# EAGLE schematic SolarZ (EAGLE 9.3.1)
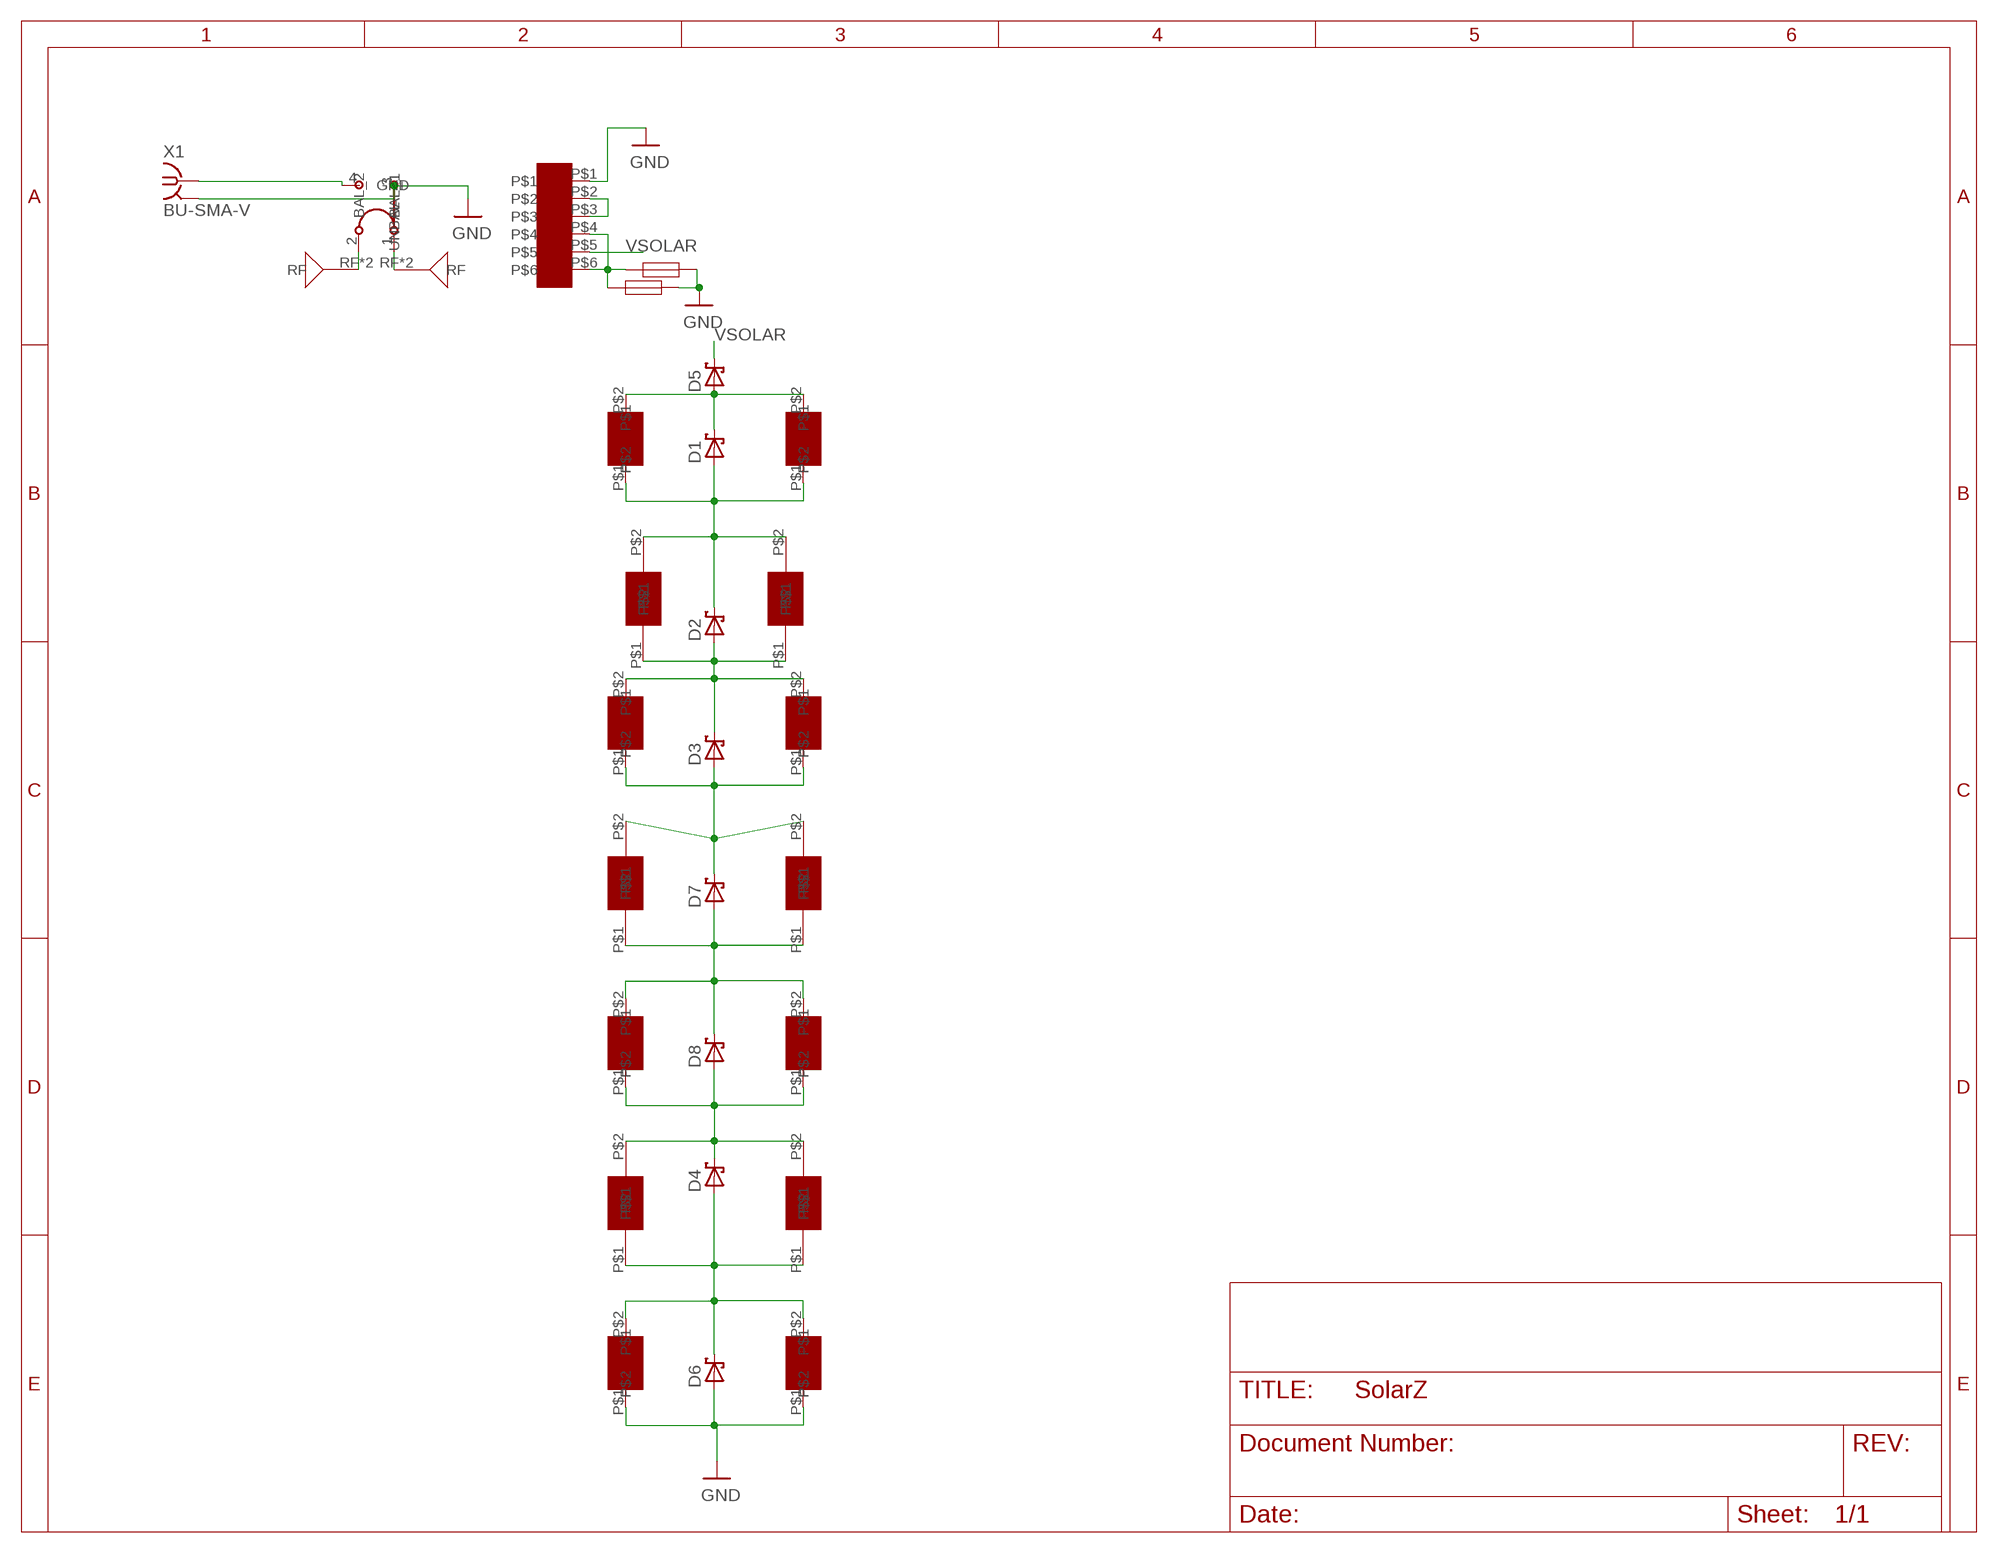
[diagram p0: schematic, sheet 1]

## Parts
1  KXOB22-04X3F  [KXOB22-04X3F]
2  SLMD121H04L  [SLMD121H04L]
3  SLMD121H04L  [SLMD121H04L]
4  SLMD121H04L  [SLMD121H04L]
5  SLMD121H04L  [SLMD121H04L]
6  KXOB22-04X3F  [KXOB22-04X3F]
7  KXOB22-04X3F  [KXOB22-04X3F]
8  SLMD121H04L  [SLMD121H04L]
9  SLMD121H04L  [SLMD121H04L]
10  KXOB22-04X3F  [KXOB22-04X3F]
11  KXOB22-04X3F  [KXOB22-04X3F]
12  SLMD121H04L  [SLMD121H04L]
13  KXOB22-04X3F  [KXOB22-04X3F]
14  SLMD121H04L  [SLMD121H04L]
D1  SB_DIODE  [SB_DIODE]
D2  SB_DIODE  [SB_DIODE]
D3  SB_DIODE  [SB_DIODE]
D4  SB_DIODE  [SB_DIODE]
D5  SB_DIODE  [SB_DIODE]
D6  SB_DIODE  [SB_DIODE]
D7  SB_DIODE  [SB_DIODE]
D8  SB_DIODE  [SB_DIODE]
F1  BURN_TERM  [BURN_WIRE]
F2  BURN_TERM  [BURN_WIRE]
U$1  BALUN  [BALUN]
U$2  ANTENNA  [TAPE]
U$3  ANTENNA  [TAPE]
U$4  M20-8760342  [M20-8760342]
X1  BU-SMA-V  [BU-SMA-V]

## Nets
GND: 8.P$1 9.P$1 D6.POS F1.2 F1.20 F1.200 F2.2 F2.20 F2.200 U$1.3(UNBAL) U$4.P$1 X1.2 X1.3 X1.4 X1.5
N8: 6.P$2 7.P$2 12.P$1 14.P$1 D4.NEG D8.POS
N$1: U$1.2(BAL_2) U$3.RF U$3.RF_2(RF)
N$2: U$1.4(GND) X1.1
N$3: U$1.1(BAL_1) U$2.RF U$2.RF_2(RF)
N$6: 1.P$2 2.P$1 3.P$1 13.P$2 D1.POS D2.NEG
N$7: 2.P$2 3.P$2 D1.NEG D5.POS
N$8: U$4.P$2 U$4.P$3
N$9: 10.P$1 11.P$1 12.P$2 14.P$2 D7.POS D8.NEG
N$10: 1.P$1 4.P$2 5.P$2 13.P$1 D2.POS D3.NEG
N$11: 6.P$1 7.P$1 8.P$2 9.P$2 D4.POS D6.NEG
N$12: 4.P$1 5.P$1 10.P$2 11.P$2 D3.POS D7.NEG
N$16: F1.1 F1.10 F1.100 F2.1 F2.10 F2.100 U$4.P$4 U$4.P$6
VSOLAR: D5.NEG U$4.P$5

## Library data of the parts
1 6 7 10 11 13 = Solar:KXOB22-04X3F; HEIGHT: 1.8
2-5 8 9 12 14 = Solar:SLMD121H04L; HEIGHT: 2
D1-D8 = Solar:SB_DIODE
F1 F2 = pandasat:BURN_TERM
U$1 = pandasat:BALUN
U$2 U$3 = pandasat:ANTENNA
U$4 = Solar:M20-8760342; HEIGHT: 8.64
X1 = con-coax:BU-SMA-V: FEMALE SMA CONNECTOR Radiall distributor RS 112-3794; OC_FARNELL: unknown; OC_NEWARK: unknown

## Net classes
0 default: width 0.152 mm, drill 0.3 mm, clearance 0.127 mm